# EasyEDA Pro project stm32-devboard.epro

# Schematic Schematic1
Board Name: Board1; Create Date: 2026-01-26; Page Name: P1; Project Name: stm32-devboard; Schematic Name: Schematic1; Update Date: 2026-01-27; Company: EasyEDA.com; Page Size: A4; Version: V1.0
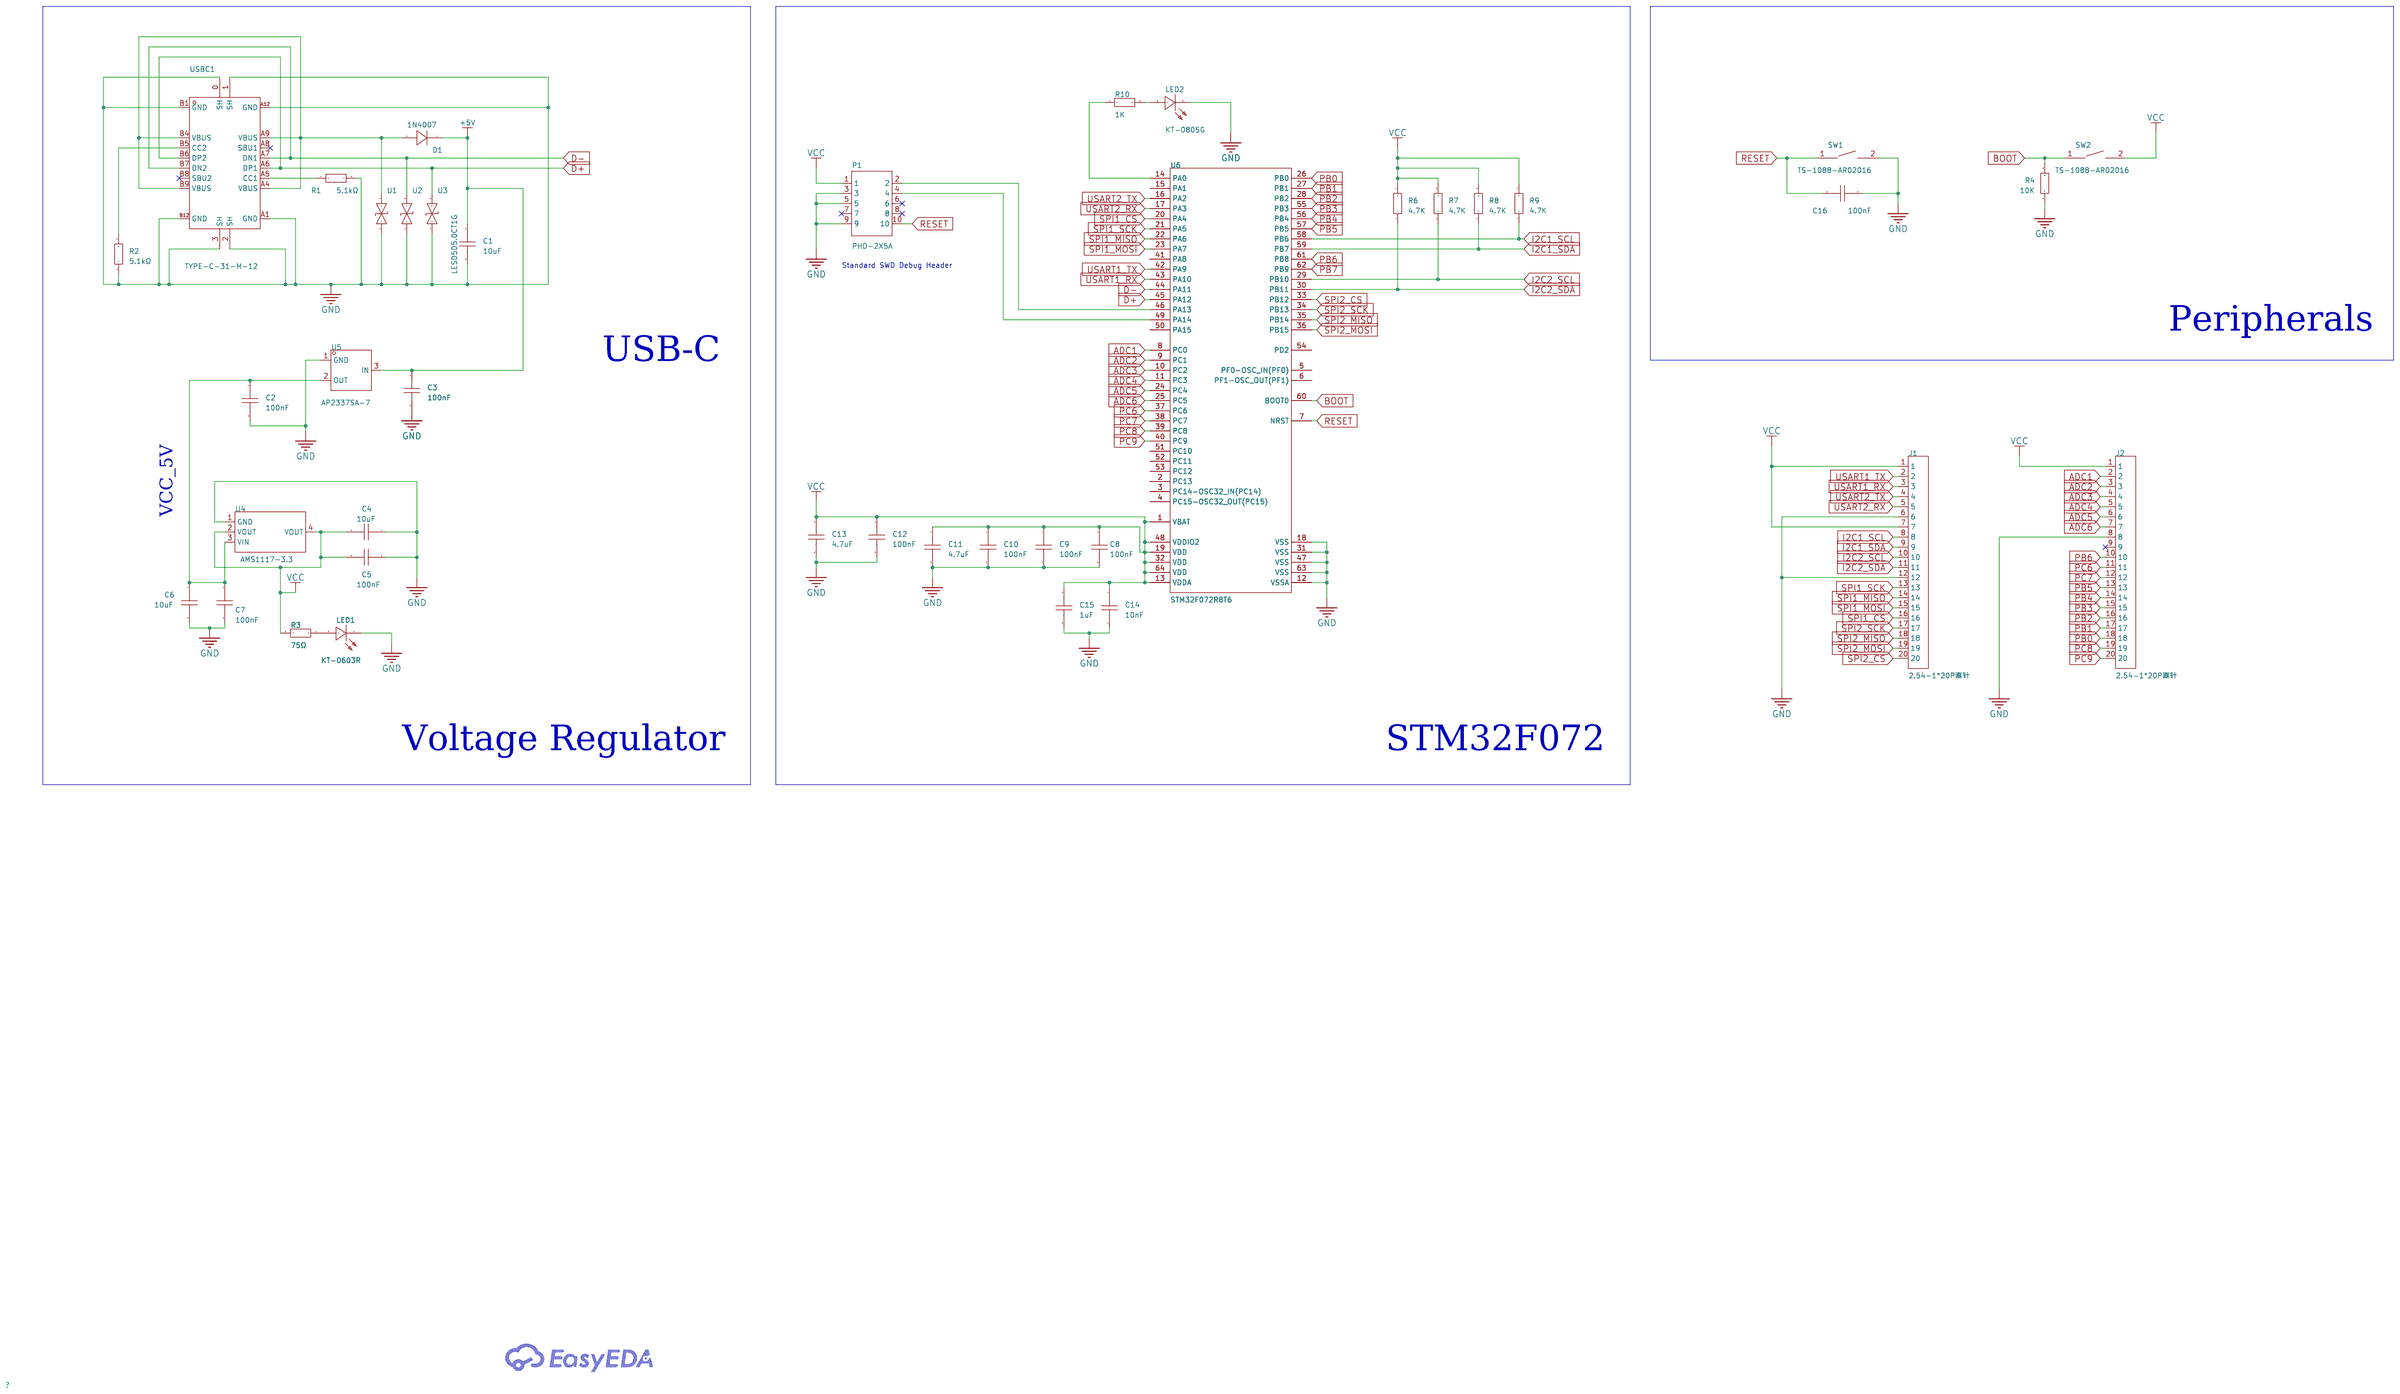
[diagram p0: schematic sheet]

## Parts
C1  10uF  [C0603]
C2  100nF  [C0603]
C3  100nF  [C0603]
C4  10uF  [C0603]
C5  100nF  [C0603]
C6  10uF  [C0603]
C7  100nF  [C0603]
C8  100nF  [C0603]
C9  100nF  [C0603]
C10  100nF  [C0603]
C11  4.7uF  [C0603]
C12  100nF  [C0603]
C13  4.7uF  [C0603]
C14  10nF  [C0603]
C15  1uF  [C0603]
C16  100nF  [C0603]
D1  1N4007  [SMA_L4.3-W2.5-LS5.0-RD]
J1  2.54-1*20P直针  [HDR-TH_20P-P2.54-V-M-1]
J2  2.54-1*20P直针  [HDR-TH_20P-P2.54-V-M-1]
LED1  KT-0603R  [LED0603-RD]
LED2  KT-0805G  [LED0805-R-RD]
P1  PHD-2X5A  [CONN-TH_10P-P2.00_PHD2.0MM-2X5]
R1  5.1kΩ  [R0603]
R2  5.1kΩ  [R0603]
R3  75Ω  [R0603]
R4  10K  [R0603]
R6  4.7K  [R0603]
R7  4.7K  [R0603]
R8  4.7K  [R0603]
R9  4.7K  [R0603]
R10  1K  [R0603]
SW1  TS-1088-AR02016  [SW-SMD_L3.9-W3.0-P4.45]
SW2  TS-1088-AR02016  [SW-SMD_L3.9-W3.0-P4.45]
U1  LESD5D5.0CT1G  [SOD-523_L1.2-W0.8-LS1.6-BI]
U2  LESD5D5.0CT1G  [SOD-523_L1.2-W0.8-LS1.6-BI]
U3  LESD5D5.0CT1G  [SOD-523_L1.2-W0.8-LS1.6-BI]
U4  AMS1117-3.3  [SOT-223-3_L6.5-W3.4-P2.30-LS7.0-BR]
U5  AP2337SA-7  [SOT-23-3_L2.9-W1.3-P1.90-LS2.4-BR]
U6  STM32F072R8T6  [LQFP-64_L10.0-W10.0-P0.50-LS12.0-BL]
USBC1  TYPE-C-31-M-12  [USB-C_SMD-TYPE-C-31-M-12]

## Library data of the parts
C1 C4 C6 = CL10A106KP8NNNC: Capacitance:10uF Tolerance:±10% Tolerance:±10% Voltage Rating:10V Temperature Coefficient:X5R; LCSC Part Name: 10uF ±10% 10V; Supplier Part: C19702; Manufacturer: SAMSUNG(三星); Supplier Footprint: 0603; JLCPCB Part Class: Basic Part; Datasheet: https://item.szlcsc.com/datasheet/CL10A106KP8NNNC/20411.html; Supplier: LCSC; Tolerance: ±10%; Voltage Rating: 10V; Temperature Coefficient: X5R
C2 C3 C5 C7 = CC0603KRX7R9BB104: Capacitance:100nF Tolerance:±10% Tolerance:±10% Voltage Rating:50V Temperature Coefficient:X7R; LCSC Part Name: 100nF ±10% 50V; Supplier Part: C14663; Manufacturer: YAGEO(国巨); Supplier Footprint: 0603; JLCPCB Part Class: Basic Part; Datasheet: https://item.szlcsc.com/datasheet/CC0603KRX7R9BB104/15331.html; Supplier: LCSC; Tolerance: ±10%; Voltage Rating: 50V; Temperature Coefficient: X7R
C8-C16 = CAP_0603: Supplier Footprint: 0603
D1 = 1N4007_C727081: Diode Configuration:Independent Voltage - Forward(Vf@If):1.1V@1A Voltage - DC Reverse(Vr):1kV Current - Rectified:1A Reverse Leakage Current (Ir):5uA; Supplier Part: C727081; Manufacturer: TWGMC(迪嘉); Supplier Footprint: SMA(DO-214AC); JLCPCB Part Class: Extended Part; Datasheet: https://item.szlcsc.com/datasheet/1N4007/774186.html; Supplier: LCSC; Diode Configuration: Independent; Voltage - Forward(Vf@If): 1.1V@1A; Voltage - DC Reverse(Vr): 1kV; Current - Rectified: 1A; Reverse Leakage Current (Ir): 5uA
J1 J2 = 2.54-1*20P直针: Pin Structure:1x20P Pitch:2.54mm Row Spacing:- Circluar Pins/Square Pins:Pin Header Mounting Type:Through Hole Number of Rows:1 Number of Pins:20P Current Rating:3A Voltage Rating (Max):- Length of Mating Pin:- Insulation Height:- Length of End Connection; LCSC Part Name: 1x20P 间距:2.54mm 方针 直插; Supplier Part: C50981; Manufacturer: BOOMELE(博穆精密); Supplier Footprint: 插件,P=2.54mm; JLCPCB Part Class: Extended Part; Datasheet: https://item.szlcsc.com/datasheet/2.54-1*20P%25E7%259B%25B4%25E9%2592%2588/51993.html; Supplier: LCSC; Pin Structure: 1x20P; Pitch: 2.54mm; Circluar Pins/Square Pins: Pin Header; Mounting Type: Through Hole; Number of Rows: 1; Number of Pins: 20P; Current Rating: 3A; Contact Material: Brass; Operating Temperature: -40℃~+105℃; Color: Black
LED1 = KT-0603R: Emitted Color:Red Power Dissipation:- Forward Current:- Dominant Wavelength:- Dominant Wavelength:- Peak Wavelength:- Diode Configuration:- Lens Color:- Color Temperature:- Color Temperature:- Viewing Angle:- Mounting Sytle:- Operating Temperature:-40℃~+8; LCSC Part Name: 0603 红灯 高亮; Supplier Part: C2286; Manufacturer: KENTO; Supplier Footprint: 0603; JLCPCB Part Class: Basic Part; Datasheet: https://atta.szlcsc.com/upload/public/pdf/source/20160616/1466072038404.pdf; Supplier: LCSC; Emitted Color: Red; Operating Temperature: -40℃~+85℃
LED2 = KT-0805G: Lamp Holder Type:- Illumination Color:Emerald Green Voltage - Forward(Vf):2.6V~3.1V Voltage - Forward(Vf):2.6V~3.1V Power(Watts):100mW Forward Current:5mA Wavelength - Dominant:513nm~528nm Wavelength - Dominant:513nm~528nm Peak Wavelength:525nm Diode Conf; LCSC Part Name: 0805 翠绿 高亮; Supplier Part: C2297; Manufacturer: KENTO; Supplier Footprint: 0805; JLCPCB Part Class: Basic Part; Datasheet: https://item.szlcsc.com/datasheet/KT-0805G/2670.html; Supplier: LCSC; Illumination Color: Emerald Green; Voltage - Forward(Vf): 2.6V~3.1V; Power(Watts): 100mW; Forward Current: 5mA; Wavelength - Dominant: 513nm~528nm; Peak Wavelength: 525nm; Luminous Intensity: 430mcd; Viewing Angle: 120°; Operating Temperature: -40℃~+85℃
P1 = PHD-2X5A: Pins Structure:2x5P Pitch:2mm Mounting Type:Through Hole Reference Series:PHD Number of Pins:10P Number of Rows:2 Number of PINs Per Row:5 Row Spacing:2mm Current Rating:2A Contact Material:- Contact Plating:- Operating Temperature:-25℃~+85℃ Operating Tem; LCSC Part Name: 2x5P 间距:2mm 直插 系列:PHD; Supplier Part: C49123; Manufacturer: BOOMELE(博穆精密); Supplier Footprint: 插件,P=2mm; JLCPCB Part Class: Extended Part; Datasheet: https://item.szlcsc.com/datasheet/PHD-2X5A/50131.html; Supplier: LCSC; Pins Structure: 2x5P; Pitch: 2mm; Mounting Type: Through Hole; Reference Series: PHD; Number of Pins: 10P; Number of Rows: 2; Number of PINs Per Row: 5; Row Spacing: 2mm; Current Rating: 2A; Operating Temperature: -25℃~+85℃; Voltage Rating: 250V; Plastic Material: PA; Flame Retardant Rating: UL94V-0; Color: Beige; Z-Height of the Board: 6.6mm
R1 R2 = 0603WAF5101T5E: Type:Thick Film Resistor Resistance:5.1kΩ Tolerance:±1% Tolerance:±1% Power(Watts):100mW Voltage-Supply(Max):75V Temperature Coefficient:±100ppm/℃ Temperature Coefficient:±100ppm/℃ Operating Temperature:-55℃~+155℃ Operating Temperature:-55℃~+155℃; LCSC Part Name: 5.1kΩ ±1% 100mW 厚膜电阻; Supplier Part: C23186; Manufacturer: UNI-ROYAL(厚声); Supplier Footprint: 0603; JLCPCB Part Class: Basic Part; Datasheet: https://item.szlcsc.com/datasheet/0603WAF5101T5E/23913.html; Supplier: LCSC; Type: Thick Film Resistor; Tolerance: ±1%; Power(Watts): 100mW; Voltage-Supply(Max): 75V; Temperature Coefficient: ±100ppm/℃; Operating Temperature: -55℃~+155℃
R3 = 0603WAF750JT5E: Type:Thick Film Resistor Resistance:75Ω Tolerance:±1% Tolerance:±1% Power(Watts):100mW Voltage-Supply(Max):75V Temperature Coefficient:±100ppm/℃ Temperature Coefficient:±100ppm/℃ Operating Temperature:-55℃~+155℃ Operating Temperature:-55℃~+155℃; LCSC Part Name: 75Ω ±1% 100mW 厚膜电阻; Supplier Part: C4275; Manufacturer: UNI-ROYAL(厚声); Supplier Footprint: 0603; JLCPCB Part Class: Basic Part; Datasheet: https://item.szlcsc.com/datasheet/0603WAF750JT5E/4682.html; Supplier: LCSC; Type: Thick Film Resistor; Tolerance: ±1%; Power(Watts): 100mW; Voltage-Supply(Max): 75V; Temperature Coefficient: ±100ppm/℃; Operating Temperature: -55℃~+155℃
R4 R6-R10 = Res_0603: Supplier Footprint: 0603
SW1 SW2 = TS-1088-AR02016: Circuit:SPST Actuator Style:Round Button Operating Force:1.6N Mounting Type:Surface Mount,Vertical Length:4mm Width:3mm Switch Height:2mm with Bracket:Without Bracket Contact Current:50mA Voltage Rating:12V Actuator/Cap Color:Black Termination Style:SMD(S; LCSC Part Name: 4*3*2mm 立贴 轻触开关; Supplier Part: C720477; Manufacturer: XUNPU(讯普); Supplier Footprint: SMD,4x3mm; JLCPCB Part Class: Basic Part; Datasheet: https://item.szlcsc.com/datasheet/TS-1088-AR02016/763484.html; Supplier: LCSC; Circuit: SPST; Actuator Style: Round Button; Operating Force: 1.6N; Mounting Type: Surface Mount,Vertical; Length: 4mm; Width: 3mm; Switch Height: 2mm; with Bracket: Without Bracket; Contact Current: 50mA; Voltage Rating: 12V; Actuator/Cap Color: Black; Termination Style: SMD(SMT) Tab; Life: 100,000 Cycles; Operating Temperature: -30℃~+80℃
U1-U3 = LESD5D5.0CT1G_C5246195: Supplier Part: C5246195; Manufacturer: Leiditech(雷卯电子); Supplier Footprint: SOD-523; JLCPCB Part Class: Extended Part; Datasheet: https://atta.szlcsc.com/upload/public/pdf/source/20221108/1C42B36F7D16189BC2911DA9C8277455.pdf; Supplier: LCSC
U4 = AMS1117-3.3_C6186: Output Type:Fixed Voltage - Supply:16V Output Voltage:3.3V Output Voltage:3.3V Output Current:1A Power Supply Rejection Ratio (PSRR):72dB@(120Hz) Voltage Dropout:1.1V@(800mA) standby current:5mA Noise:- Features:Over Current Protection；Over Temperature Pr; LCSC Part Name: 输出3.3V 1A; Supplier Part: C6186; Manufacturer: AMS; Supplier Footprint: SOT-223; JLCPCB Part Class: Basic Part; Datasheet: https://item.szlcsc.com/datasheet/AMS1117-3.3/6652.html; Supplier: LCSC; Output Type: Fixed; Voltage - Supply: 16V; Output Voltage: 3.3V; Output Current: 1A; Power Supply Rejection Ratio (PSRR): 72dB@(120Hz); Voltage Dropout: 1.1V@(800mA); standby current: 5mA; Features: Over Current Protection；Over Temperature Protection; Operating Temperature: -40℃~+125℃; Output Configuration: Positive; Number of Outputs: 1
U5 = AP2337SA-7: Type:Load Switch Number of Channels:1 Control Input Logic:- Maximum Continuous Current:1A Voltage - Supply:2.7V~5.5V Voltage - Supply:2.7V~5.5V RDS(on):110mΩ Operating Temperature	-:-40℃~+85℃ Operating Temperature	-:-40℃~+85℃ Features:Over Temperature Pro; LCSC Part Name: 1.0A单通道限流负载开关; Supplier Part: C150497; Manufacturer: DIODES(美台); Supplier Footprint: SOT-23; JLCPCB Part Class: Extended Part; Datasheet: https://item.szlcsc.com/datasheet/AP2337SA-7/161835.html; Supplier: LCSC; Type: Load Switch; Number of Channels: 1; Maximum Continuous Current: 1A; Voltage - Supply: 2.7V~5.5V; RDS(on): 110mΩ; Operating Temperature	-: -40℃~+85℃; Features: Over Temperature Protection；Over Voltage Protection；Short-Circuit  Protection(SCP)；Overcurrent Protection(OCP)；Undervoltage Protection(UVP)
U6 = STM32F072R8T6: CPU Core:ARM-M0 CPU Maximum Speed:48MHz Program Storage Size:64KB Number of I/O:51 ADC (Bit):12bit DAC (Bit):12bit Low Voltage Detection Threshold:1.65V~3.6V Low Voltage Detection Threshold:1.65V~3.6V Application Area:-; LCSC Part Name: 主流ARM Cortex-M0 USB系列MCU，具有64 KB Flash、48 MHz CPU、USB、CAN和CEC功能; Supplier Part: C87900; Manufacturer: ST(意法半导体); Supplier Footprint: LQFP-64(10x10); JLCPCB Part Class: Extended Part; Datasheet: https://atta.szlcsc.com/upload/public/pdf/source/20170105/1483610796165.pdf; Supplier: LCSC; CPU Core: ARM-M0; CPU Maximum Speed: 48MHz; Program Storage Size: 64KB; Number of I/O: 51; ADC (Bit): 12bit; DAC (Bit): 12bit; Low Voltage Detection Threshold: 1.65V~3.6V
USBC1 = TYPE-C-31-M-12: Connector Type:Type-C Standard:- Gender:Female Mounting Style:- Number of Contacts:16P Number of Ports:1 Current Rating - Power (Max):5A Operating Temperature Range:- Operating Temperature Range:-; LCSC Part Name: Type-C 母; Supplier Part: C165948; Manufacturer: 韩国韩荣; Supplier Footprint: SMD; JLCPCB Part Class: Extended Part; Datasheet: https://atta.szlcsc.com/upload/public/pdf/source/20220525/466408E853115E789EDB0DDC29077C05.pdf; Supplier: LCSC; Connector Type: Type-C; Gender: Female; Number of Contacts: 16P; Number of Ports: 1; Current Rating - Power (Max): 5A

## Nets
+5V: C1.1 C3.1 D1.1(K) U5.3(IN)
GND: C1.2 C2.2 C3.2 C4.1 C5.1 C6.2 C7.2 C8.2 C9.2 C10.2 C11.2 C12.2 C13.2 C14.2 C15.2 C16.1 J1.6 J1.12 J2.8 LED1.1(K) LED2.2(K) P1.3 P1.5 P1.9 R1.2 R2.1 R4.1 SW1.2 U1.1 U2.1 U3.1 U4.1(GND) U5.1(GND) U6.12(VSSA) U6.18(VSS) U6.31(VSS) U6.47(VSS) U6.63(VSS) USBC1.0(SH) USBC1.1(SH) USBC1.2(SH) USBC1.3(SH) USBC1.A1(GND) USBC1.A12(GND) USBC1.B1(GND) USBC1.B12(GND)
VCC: C4.2 C5.2 C8.1 C9.1 C10.1 C11.1 C12.1 C13.1 C14.1 C15.1 J1.1 J1.7 J2.1 P1.1 R3.2 R6.2 R7.2 R8.2 R9.2 SW2.2 U4.2(VOUT) U4.4(VOUT) U6.1(VBAT) U6.13(VDDA) U6.19(VDD) U6.32(VDD) U6.48(VDDIO2) U6.64(VDD)
ADC1: J2.2 U6.8(PC0)
ADC2: J2.3 U6.9(PC1)
ADC3: J2.4 U6.10(PC2)
ADC4: J2.5 U6.11(PC3)
ADC5: J2.6 U6.24(PC4)
ADC6: J2.7 U6.25(PC5)
BOOT: R4.2 SW2.1 U6.60(BOOT0)
D+: U3.2 U6.45(PA12) USBC1.A6(DP1) USBC1.B6(DP2)
D-: U2.2 U6.44(PA11) USBC1.A7(DN1) USBC1.B7(DN2)
I2C1_SCL: J1.8 R9.1 U6.58(PB6)
I2C1_SDA: J1.9 R8.1 U6.59(PB7)
I2C2_SCL: J1.10 R7.1 U6.29(PB10)
I2C2_SDA: J1.11 R6.1 U6.30(PB11)
PB0: J2.18 U6.26(PB0)
PB1: J2.17 U6.27(PB1)
PB2: J2.16 U6.28(PB2)
PB3: J2.15 U6.55(PB3)
PB4: J2.14 U6.56(PB4)
PB5: J2.13 U6.57(PB5)
PB6: J2.10 U6.61(PB8)
PB7: U6.62(PB9)
PC6: J2.11 U6.37(PC6)
PC7: J2.12 U6.38(PC7)
PC8: J2.19 U6.39(PC8)
PC9: J2.20 U6.40(PC9)
RESET: C16.2 P1.10 SW1.1 U6.7(NRST)
SPI1_CS: J1.16 U6.20(PA4)
SPI1_MISO: J1.14 U6.22(PA6)
SPI1_MOSI: J1.15 U6.23(PA7)
SPI1_SCK: J1.13 U6.21(PA5)
SPI2_CS: J1.20 U6.33(PB12)
SPI2_MISO: J1.18 U6.35(PB14)
SPI2_MOSI: J1.19 U6.36(PB15)
SPI2_SCK: J1.17 U6.34(PB13)
USART1_RX: J1.3 U6.43(PA10)
USART1_TX: J1.2 U6.42(PA9)
USART2_RX: J1.5 U6.17(PA3)
USART2_TX: J1.4 U6.16(PA2)
$1N878: R1.1 USBC1.A5(CC1)
$1N879: R2.2 USBC1.B5(CC2)
$1N882: D1.2(A) U1.2 USBC1.A4(VBUS) USBC1.A9(VBUS) USBC1.B4(VBUS) USBC1.B9(VBUS)
$1N887: LED1.2(A) R3.1
$1N888: C2.1 C6.1 C7.1 U4.3(VIN) U5.2(OUT)
$1N4590: P1.2 U6.46(PA13)
$1N4596: P1.4 U6.49(PA14)
$1N7474: LED2.1(A) R10.2
$1N7510: R10.1 U6.14(PA0)

Not connected (* = marked no-connect by the designer): J2 9*; P1 6* 7* 8*; U6 2(PC13) 3(PC14-OSC32_IN(PC14)) 4(PC15-OSC32_OUT(PC15)) 5(PF0-OSC_IN(PF0)) 6(PF1-OSC_OUT(PF1)) 15(PA1) 41(PA8) 50(PA15) 51(PC10) 52(PC11) 53(PC12) 54(PD2); USBC1 A8(SBU1)* B8(SBU2)*

## Notes on the sheet
- Standard SWD Debug Header
- Peripherals
- USB-C
- VCC_5V
- Voltage Regulator
- STM32F072

# Board PCB1
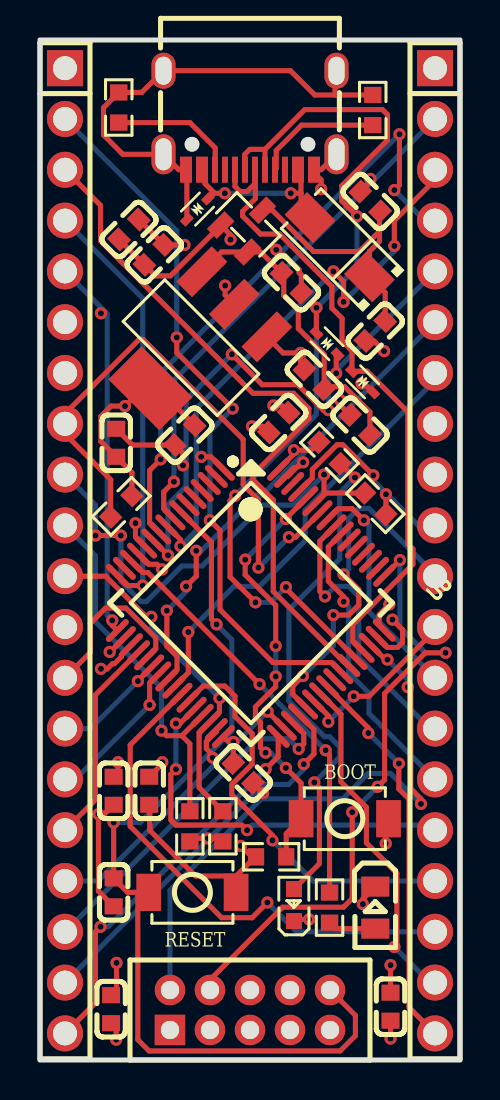
[diagram p1: board, top side]
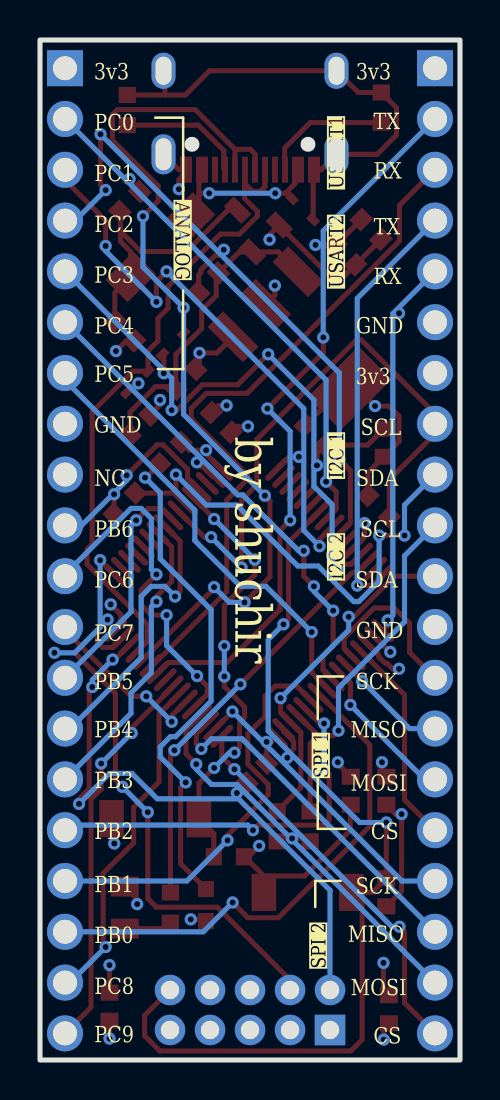
[diagram p2: board, bottom side, seen from below]

Outline 21 x 51 mm; copper layers: Top Layer, Ground, Power, Bottom Layer. Coordinates in mm from the lower left corner of the outline.
Outline path: rectangle 0,51 21,0
Stack: Top Layer 0.035mm Outer layer thickness 1oz / Dielectric1 0.2104mm 7628 RC49% 8.6mil / Ground 0.0152mm Inner layer thickness / Dielectric2 1.065mm 1.1mm H/HOZ Copper / Power 0.0152mm Inner layer thickness / Dielectric3 0.2104mm 7628 RC49% 8.6mil / Bottom Layer 0.035mm Outer layer thickness 1oz

## Design rules (mm)
template: Custom Config
spacing copperThickness1oz (default): track to track 0.102, other pairs 0.152 to 0.3
spacing copperThickness2oz: track to track 0.203, other pairs 0.152 to 0.3
track width copperThickness1oz (default): min 0.127, default 0.254, max 2.54
track width copperThickness2oz: min 0.203, default 0.254, max 2.54
differential pair differentialPair (default): width min 0.127, default 0.254, max 2.54; gap min 0.152, default 0.152
via viaSize (default): diameter min 0.5, default 0.61, max 10; hole min 0.3, default 0.305, max 6.3

## Placement (name value [footprint] x y rotation side)
C1  10uF  [C0603]  16.76 36.45 225 top
C2  100nF  [C0603]  12.57 38.86 315 top
C3  100nF  [C0603]  16.51 42.93 135 top
C4  10uF  [C0603]  5.72 40.26 45 top
C5  100nF  [C0603]  4.44 41.53 45 top
C6  10uF  [C0603]  13.72 34.04 135 top
C7  100nF  [C0603]  16 31.75 135 top
C8  100nF  [C0603]  10.16 14.35 315 top
C9  100nF  [C0603]  17.53 2.67 270 top
C10  100nF  [C0603]  11.94 31.88 45 top
C11  4.7uF  [C0603]  7.24 31.24 225 top
C12  100nF  [C0603]  3.68 13.46 270 top
C13  4.7uF  [C0603]  3.81 30.86 90 top
C14  10nF  [C0603]  3.56 2.54 270 top
C15  1uF  [C0603]  5.46 13.46 270 top
C16  100nF  [C0603]  3.68 8.38 90 top
D1  1N4007  [SMA_L4.3-W2.5-LS5.0-RD]  14.99 40.64 135 top
J1  2.54-1*20P直针  [HDR-TH_20P-P2.54-V-M-1]  1.25 25.46 270 top
J2  2.54-1*20P直针  [HDR-TH_20P-P2.54-V-M-1]  19.75 25.46 270 top
LED1  KT-0603R  [LED0603-RD]  12.7 7.75 90 top
LED2  KT-0805G  [LED0805-R-RD]  16.76 7.62 270 top
P1  PHD-2X5A  [CONN-TH_10P-P2.00_PHD2.0MM-2X5]  10.5 2.5 0 top
R1  5.1kΩ  [R0603]  16.64 47.5 90 top
R2  5.1kΩ  [R0603]  3.94 47.62 270 top
R3  75Ω  [R0603]  14.48 30.35 135 top
R4  10K  [R0603]  11.56 10.16 0 top
R6  4.7K  [R0603]  9.14 11.68 270 top
R7  4.7K  [R0603]  7.49 11.68 270 top
R8  4.7K  [R0603]  16.76 27.81 315 top
R9  4.7K  [R0603]  4.06 27.69 45 top
R10  1K  [R0603]  14.48 7.62 270 top
SW1  TS-1088-AR02016  [SW-SMD_L3.9-W3.0-P4.45]  7.62 8.38 0 top
SW2  TS-1088-AR02016  [SW-SMD_L3.9-W3.0-P4.45]  15.24 12.06 0 top
U1  LESD5D5.0CT1G  [SOD-523_L1.2-W0.8-LS1.6-BI]  7.87 42.55 45 top
U2  LESD5D5.0CT1G  [SOD-523_L1.2-W0.8-LS1.6-BI]  14.35 35.81 135 top
U3  LESD5D5.0CT1G  [SOD-523_L1.2-W0.8-LS1.6-BI]  16.13 33.91 135 top
U4  AMS1117-3.3  [SOT-223-3_L6.5-W3.4-P2.30-LS7.0-BR]  7.62 35.69 45 top
U5  AP2337SA-7  [SOT-23-3_L2.9-W1.3-P1.90-LS2.4-BR]  10.41 41.78 225 top
U6  STM32F072R8T6  [LQFP-64_L10.0-W10.0-P0.50-LS12.0-BL]  10.54 22.86 225 top
USBC1  TYPE-C-31-M-12  [USB-C_SMD-TYPE-C-31-M-12]  10.5 46.99 180 top

## Footprints (pads in the part's own frame, mm; a bottom-side part is the same pattern mirrored in y, then rotated)
C0603
  rect 0.8x0.9 smd: 1(-0.7,0) 2(0.7,0)
CONN-TH_10P-P2.00_PHD2.0MM-2X5
  rect 1.524x1.524 hole 0.914: 1(-4,-1)
  round 1.524 hole 0.914: 2(-4,1) 3(-2.002,-1) 4(-2.002,1) 5(0,-1) 6(0,1) 7(1.999,-1) 8(1.999,1) 9(4,-1) 10(4,1)
HDR-TH_20P-P2.54-V-M-1
  rect 1.8x1.8 hole 1.2: 1(-24.13,0)
  round 1.8 hole 1.2: 2(-21.59,0) 3(-19.05,0) 4(-16.51,0) 5(-13.97,0) 6(-11.43,0) 7(-8.89,0) 8(-6.35,0) 9(-3.81,0) 10(-1.27,0) 11(1.27,0) 12(3.81,0) 13(6.35,0) 14(8.89,0) 15(11.43,0) 16(13.97,0) 17(16.51,0) 18(19.05,0) 19(21.59,0) 20(24.13,0)
LED0603-RD
  rect 0.8x0.8 smd: 1(-0.799,0) 2(0.799,0)
LED0805-R-RD
  rect 1x1.399 smd: 1(1.05,0) 2(-1.05,0)
LQFP-64_L10.0-W10.0-P0.50-LS12.0-BL
  oval 0.3x1.5 smd: 1(-3.75,-5.688) 2(-3.25,-5.688) 3(-2.75,-5.688) 4(-2.25,-5.688) 5(-1.75,-5.688) 6(-1.25,-5.688) 7(-0.75,-5.688) 8(-0.25,-5.688) 9(0.25,-5.688) 10(0.75,-5.688) 11(1.25,-5.688) 12(1.75,-5.688) 13(2.25,-5.688) 14(2.75,-5.688) 15(3.25,-5.688) 16(3.75,-5.688) 33(3.75,5.688) 34(3.25,5.688) 35(2.75,5.688) 36(2.25,5.688) 37(1.75,5.688) 38(1.25,5.688) 39(0.75,5.688) 40(0.25,5.688) 41(-0.25,5.688) 42(-0.75,5.688) 43(-1.25,5.688) 44(-1.75,5.688) 45(-2.25,5.688) 46(-2.75,5.688) 47(-3.25,5.688) 48(-3.75,5.688)
  oval 1.5x0.3 smd: 17(5.7,-3.738) 18(5.7,-3.238) 19(5.7,-2.738) 20(5.7,-2.238) 21(5.7,-1.738) 22(5.7,-1.238) 23(5.7,-0.739) 24(5.7,-0.238) 25(5.7,0.262) 26(5.7,0.762) 27(5.7,1.262) 28(5.7,1.762) 29(5.7,2.261) 30(5.7,2.762) 31(5.7,3.261) 32(5.7,3.762) 49(-5.7,3.762) 50(-5.7,3.261) 51(-5.7,2.762) 52(-5.7,2.261) 53(-5.7,1.762) 54(-5.7,1.262) 55(-5.7,0.762) 56(-5.7,0.262) 57(-5.7,-0.238) 58(-5.7,-0.739) 59(-5.7,-1.238) 60(-5.7,-1.738) 61(-5.7,-2.238) 62(-5.7,-2.738) 63(-5.7,-3.238) 64(-5.7,-3.738)
R0603
  rect 0.806x0.864 smd: 1(-0.753,0) 2(0.753,0)
SMA_L4.3-W2.5-LS5.0-RD
  rect 2x1.593 smd: 1(-2.1,0) 2(2.1,0)
SOD-523_L1.2-W0.8-LS1.6-BI
  rect 0.6x0.4 smd: 1(-0.75,0) 2(0.75,0)
SOT-23-3_L2.9-W1.3-P1.90-LS2.4-BR
  rect 1.25x0.7 smd: 1(1,-0.95) 2(1,0.95) 3(-1,0)
SOT-223-3_L6.5-W3.4-P2.30-LS7.0-BR
  rect 2.5x1.1 smd: 1(2.97,-2.3) 2(2.97,0) 3(2.97,2.3)
  rect 2.34x3.6 smd: 4(-2.97,0)
SW-SMD_L3.9-W3.0-P4.45
  rect 1.23x1.86 smd: 1(-2.185,0) 2(2.185,0)
USB-C_SMD-TYPE-C-31-M-12
  oval 1.2x2 hole 0.8x1.6: 0(-4.325,1.706) 1(4.325,1.706)
  oval 1.2x1.8 hole 0.8x1.4: 2(4.325,-2.474) 3(-4.325,-2.474)
  rect 0.3x1.3 smd: A1(-3.35,2.474) A4(-2.55,2.474) A5(-1.25,2.474) A6(-0.25,2.474) A7(0.25,2.474) A8(1.25,2.474) A9(2.55,2.474) A12(3.35,2.474) B1(3.05,2.474) B4(2.25,2.474) B5(1.75,2.474) B6(0.75,2.474) B7(-0.75,2.474) B8(-1.75,2.474) B9(-2.25,2.474) B12(-3.05,2.474)

## Nets
As in the schematic.

Pads without a net: J2 9; P1 6 7 8; U6 2 3 4 5 6 15 41 50 51 52 53 54; USBC1 A8 B8

## Via types
v1: diameter 0.61, hole 0.305, Top Layer to Bottom Layer, 119 vias

## Routing (per net, layer and track width the routed paths; a pad name or vN(x,y) marks a point on that pad's centre or on a via; arc(x,y) is an arc through that point)
+5V: length 13.2
  Top Layer w0.254: 16.98,41.44 15.96,40.42 13.68,40.42 11.61,42.49 11.12,42.49 ; 16.98,41.44 16.98,40.93 16.47,40.42 16.47,39.16 17.26,38.37 17.26,36.94 ; 16.98,41.44 16.98,42.41 C3.1
GND: length 83.4
  Top Layer w0.254: C15.2 5.49,12.74 5.49,11.49 7.77,9.2 9.81,9.2 ; 16.86,21.14 17.37,20.63 17.88,20.63 18.13,20.88 18.13,21.51 v1(17.62,22.02) ; 14.75,48.25 14.75,49.39 USBC1.3 ; 14.75,48.25 R1.2 ; 14.75,48.25 13.74,48.25 12.53,49.46 USBC1.2 5.09,48.38 R2.1 3.18,47.62 3.18,46.25 4.14,45.28 USBC1.1 6.94,44.52 USBC1.A12 7.26,44.41 7.34,44.41 ; U6.12 4.77,26.15 v1(4.77,26.85) ; U4.1 12.15,35.35 v1(13.03,35.35) 13.03,34.72 13.22,34.53 ; v1(16.52,44.05) 16.52,43.93 C3.2 ; 10.55,10.2 10.76,10.2 R4.1 ; 10.55,10.2 10.55,9.94 9.81,9.2 ; 10.55,10.2 v1(10.04,10.71) ; v1(9.53,41.02) 9.53,41.26 U5.1 9.03,41.72 6.52,39.21 5.78,39.21 C4.1 C5.1 ; 9.81,9.2 SW1.2 ; U3.1 16.21,33.83 v1(16.08,33.83) ; U6.18 3.5,20.4 v1(3.48,20.4) ; v1(14.81,34.34) 14.81,35.21 U2.1 ; C16.1 2.92,8.44 v1(2.92,12.29) 3.21,12.29 C12.2 ; v1(11.67,32.73) 12.08,32.73 C10.2 ; LED1.1 12.78,7.03 v1(13.46,7.03) ; LED2.2 16.14,8.05 v1(16.14,7.79) ; v1(3.81,1.02) 3.81,1.59 C14.2 ; C7.2 15,32.75 v1(15,33) ; 7.34,44.41 USBC1.B1 ; 7.34,44.41 U1.1 ; 16.27,35.95 16.69,35.95 v1(17.2,35.45) ; C9.2 v1(17.53,1.07) ; v1(7.15,29.73) 7.15,30.34 C11.2 4.62,30.75 C13.2 ; USBC1.0 14.06,44.52 USBC1.A1 USBC1.B12 14.06,44.01 v1(14.06,43.54) ; U6.63 12.38,29.18 12.88,29.68 12.95,29.68 v1(13.16,29.89) ; 11.16,13.35 10.66,13.86 ; v1(8.64,15.11) 8.64,15.25 8.32,15.57 8.32,15.92 8.82,16.42 U6.31 ; C2.2 13.07,39.26 12.96,39.37 12.96,39.51 12.23,40.24 12.09,40.24 v1(11.81,40.51)
  Ground w0.254: 1.25,36.89 2.6,36.89 v1(3.05,37.34) ; P1.5 P1.3
  vias: v1(11.16,13.35)
VCC: length 35.5
  Top Layer w0.254: R6.2 9,11.08 v1(8.4,11.08) 7.64,11.08 R7.2 ; SW2.2 17.29,11.93 v1(17.29,10.83) ; v1(7.23,40.75) C4.2 C5.2 ; 9.66,14.85 v1(9.67,15.91) 9.44,15.91 U6.32 ; U4.2 9.26,38.25 v1(9.26,38.72) ; U6.1 8.55,30.16 v1(8.06,30.16) ; C10.1 11.14,31.68 v1(10.6,31.68) ; v1(3.83,4.86) 3.83,3.51 C14.1 ; 17.22,21.49 16.96,21.74 16.96,22.27 v1(17.47,22.78) ; v1(6.11,24.53) 5.86,24.78 5.44,24.78 U6.13 ; v1(3.9,14.89) 3.9,14.38 C12.1 ; C11.1 5.88,33.59 5.52,33.59 5.39,33.46 5.01,33.46 v1(4.25,32.7) 3.56,32.7 3.05,32.19 3.05,30.92 C13.1 4.6,29.37 R9.2 ; U6.19 4.07,20.26 4.07,20.16 3.73,19.82 3.63,19.82 3.37,19.56 v1(3.05,19.56) ; R3.2 13.55,30.49 v1(12.69,30.49) 12.69,30.3 U6.64 ; v1(17.53,4.75) C9.1 ; v1(6.11,14.89) 6.11,14.81 C15.1 ; v1(17.3,28.29) R8.2
ADC1: length 25.8
  Top Layer w0.254: 6.7,27.06 6.19,27.57 6.19,28.41 v1(6.7,28.92)
  Bottom Layer w0.254: v1(6.7,28.92) 6.7,34 J2.2
ADC2: length 28.4
  Top Layer w0.254: v1(15.18,37.91) 15.18,38.92 v1(14.67,39.43) ; v1(7.03,25.69) 7.03,26.02 U6.9 ; v1(17.72,40.7) 17.72,41.97 19.75,44 J2.3
  Bottom Layer w0.254: v1(15.18,37.91) 17.72,40.45 v1(17.72,40.7) ; v1(14.67,39.43) 7.81,32.57 7.81,26.48 v1(7.03,25.69)
ADC3: length 30.9
  Top Layer w0.254: v1(17.97,46.29) 17.97,43.75 v1(17.72,43.5) ; U6.10 5.48,26.86 5.48,29.48 v1(6.03,30.03)
  Bottom Layer w0.254: J2.4 19.24,41.97 v1(17.72,43.5) ; v1(17.97,46.29) 6.03,34.35 v1(6.03,30.03)
ADC4: length 27.6
  Top Layer w0.254: v1(14.42,32.49) 14.16,32.49 12.89,33.76 11.11,33.76 v1(9.59,35.29) ; v1(6.4,25.24) U6.11
  Bottom Layer w0.254: J2.5 14.42,34.1 v1(14.42,32.49) ; v1(9.59,35.29) 7.3,33 7.3,28.68 6.4,27.78 v1(6.4,25.24)
ADC5: length 24.2
  Top Layer w0.254: v1(7.81,25.46) 7.81,24.19 v1(7.3,23.68) ; U6.24 6.85,19.51 6.85,20.18 6.34,20.69 v1(6.34,22.47)
  Bottom Layer w0.254: v1(7.81,25.46) 8.07,25.46 10.86,28.25 11.11,28.25 19.75,36.89 ; v1(7.3,23.68) 7.3,23.43 v1(6.34,22.47)
ADC6: length 21.9
  Top Layer w0.254: U6.25 7.42,19.36 v1(7.42,21.4)
  Bottom Layer w0.254: J2.7 19.75,33.98 13.26,27.49 13.26,25.97 10.97,23.68 9.7,23.68 v1(7.42,21.4)
BOOT: length 21.7
  Top Layer w0.254: v1(12.29,14.61) 13.06,13.84 SW2.1 12.31,11.32 R4.2 ; v1(11.78,19.18) 11.78,18.67 10.77,17.65 10.77,17.14 11.02,16.89 11.02,15.62 v1(11.28,15.37) ; U6.60 12.29,27.07 v1(12.29,27.05) ; v1(10.26,25.02) 10.26,24.26 11.78,22.73 v1(11.78,20.7)
  Bottom Layer w0.254: v1(10.26,25.02) v1(12.29,27.05) ; v1(11.78,19.18) v1(11.78,20.7) ; v1(11.28,15.37) 11.53,15.37 v1(12.29,14.61)
D+: length 32.5
  Top Layer w0.254: 10.77,43.84 10.77,43.08 10.13,42.43 10.13,42.2 11.03,41.3 11.98,41.3 14.59,38.68 14.59,37.59 15.1,37.08 15.1,35.95 15.6,35.46 U3.2 16.36,34.44 18.39,32.41 18.39,25.8 18.65,25.55 18.65,24.79 15.65,21.79 15.65,20.94 U6.45 ; 10.77,43.84 10.77,44.49 USBC1.A6 ; 10.77,43.84 10.36,43.43 10,43.43 9.75,43.68 USBC1.B6
D-: length 46.9
  Top Layer w0.254: 11.25,45.53 USBC1.B7 ; 11.25,45.53 13.24,47.52 17.12,47.52 17.38,47.27 17.38,46 15.09,43.71 15.09,42.95 v1(15.85,42.19) ; 11.25,45.53 10.49,45.53 10.23,45.28 10.23,44.53 USBC1.A7 ; v1(9.76,28.22) 9.5,27.96 9.5,24.15 v1(10.77,22.88) ; v1(12.3,23.64) 12.3,23.58 U6.44 ; U2.2 v1(13.82,37.61)
  Bottom Layer w0.254: v1(9.76,28.22) 13.82,32.28 v1(13.82,37.61) 15.85,39.65 v1(15.85,42.19) ; v1(10.77,22.88) 11.53,22.88 v1(12.3,23.64)
I2C1_SCL: length 29.6
  Top Layer w0.254: v1(10.92,24.62) 10.92,28 10.16,28.76 10.16,31.03 5.16,36.03 4.96,36.03 1.25,32.32 J1.8 1.25,31.3 3.54,29.02 3.54,27.16 ; U6.58 12.78,26.14 v1(12.44,26.14)
  Bottom Layer w0.254: v1(10.92,24.62) v1(12.44,26.14)
I2C1_SDA: length 24.2
  Top Layer w0.254: 14.2,28.25 14.29,28.35 R8.1 ; v1(2.77,26.22) v1(4.04,26.22) ; v1(14.2,29.27) 14.2,28.26 14.19,28.25 U6.59
  Bottom Layer w0.254: v1(2.77,26.22) 2.77,27.75 J1.9 ; v1(4.04,26.22) 4.04,23.94 5.06,22.92 5.31,22.92 7.09,24.7 8.11,24.7 11.16,27.75 12.68,27.75 v1(14.2,29.27)
I2C2_SCL: length 18.8
  Top Layer w0.254: R7.1 7.49,15.81 7.09,16.21 6.33,16.21 v1(6.08,16.47) ; 7.09,16.21 U6.29
  Bottom Layer w0.254: v1(6.08,16.47) 6.08,18.6 2.77,21.91 2.77,25.21 J1.10
I2C2_SDA: length 17.2
  Top Layer w0.254: R6.1 7.96,13.63 7.96,16.37 U6.30 8.97,17.38 v1(8.97,18.09) ; v1(5.57,22.16) 5.31,22.16 3.28,24.19 J1.11
  Bottom Layer w0.254: v1(5.57,22.16) 5.57,21.5 v1(8.97,18.09)
PB0: length 25.7
  Top Layer w0.254: 7.05,18.29 4.51,15.75 4.51,11.69 9.08,7.11 10.61,7.11 v1(11.37,7.88)
  Bottom Layer w0.254: J2.18 12.83,6.41 v1(11.37,7.88)
PB1: length 20.7
  Top Layer w0.254: v1(11.62,10.98) 11.62,11.24 9.59,13.27 9.59,13.78 10.61,14.79 10.61,16.32 9.75,17.18 9.75,18.19 9.24,18.7 8.16,18.7 U6.27
  Bottom Layer w0.254: J2.17 13.65,8.95 v1(11.62,10.98)
PB2: length 19.8
  Top Layer w0.254: v1(6.8,14.54) 6.54,14.28 6.54,12 6.8,11.75 10.1,11.75 v1(10.35,11.49) ; v1(6.8,16.83) 7,16.83 U6.28
  Bottom Layer w0.254: J2.16 19.5,11.75 10.61,11.75 v1(10.35,11.49) ; v1(6.8,14.54) v1(6.8,16.83)
PB3: length 14.8
  Top Layer w0.254: v1(15.18,22.92) 15.18,23.17 14.42,23.94 14.42,25.66 U6.55
  Bottom Layer w0.254: J2.15 16.45,17.33 16.45,18.35 15.43,19.36 15.43,22.67 v1(15.18,22.92)
PB4: length 14.4
  Top Layer w0.254: v1(14.25,23.17) 13.99,23.43 13.99,25.94 U6.56
  Bottom Layer w0.254: J2.14 19.5,16.57 15.94,20.13 15.94,23.17 15.43,23.68 14.76,23.68 v1(14.25,23.17)
PB5: length 11.6
  Top Layer w0.254: 14.4,27.06 14.91,27.57 15.61,27.57 v1(16.19,26.98)
  Bottom Layer w0.254: v1(16.19,26.98) 16.45,26.73 16.45,22.41 J2.13
PB6: length 9.8
  Top Layer w0.254: v1(16.67,29.23) 15.14,30.76 14.85,30.76 13.62,29.53 13.62,29.1 12.99,28.47
  Bottom Layer w0.254: J2.10 18.92,26.73 16.67,28.98 v1(16.67,29.23)
PC6: length 18
  Top Layer w0.254: U6.37 12.64,18.29 12.64,18.69 v1(13.15,19.2) ; v1(15.18,24.28) 15.94,23.52 15.94,22.75 15.43,22.25 v1(14.67,22.25)
  Bottom Layer w0.254: v1(15.18,24.28) 15.43,24.53 15.43,27.07 15.94,27.58 16.45,27.58 19.75,24.28 J2.11 ; v1(14.67,22.25) 14.67,20.72 v1(13.15,19.2)
PC7: length 8.7
  Top Layer w0.254: v1(14.42,16.91) 14.42,17.22 U6.38 ; J2.12 19.75,21.48 16.45,18.18 v1(15.69,18.18)
  Bottom Layer w0.254: v1(15.69,18.18) v1(14.42,16.91)
PC8: length 17.1
  Top Layer w0.254: v1(17.72,5.65) 17.84,5.77 17.84,9.33 16.32,10.86 16.32,12.64 15.05,13.91 15.05,17.29 U6.39
  Bottom Layer w0.254: J2.19 19.5,3.87 v1(17.72,5.65)
PC9: length 19.6
  Top Layer w0.254: v1(17.94,14.82) 17.94,13.55 18.45,13.05 18.45,2.63 J2.20 ; v1(16.42,16.35) 16.42,16.6 14.39,18.63 14.39,18.66
  Bottom Layer w0.254: v1(17.94,14.82) v1(16.42,16.35)
RESET: length 46.3
  Top Layer w0.254: 7.05,27.41 8.57,25.89 8.57,22.04 v1(8.83,21.78) ; 4.89,8.38 4.89,1.02 5.46,0.45 15.01,0.45 15.77,1.21 15.77,2.23 P1.10 ; 4.89,8.38 SW1.1 ; 4.89,8.38 4.38,8.38 C16.2 v1(3.68,11.88)
  Bottom Layer w0.254: v1(3.68,11.88) 5.02,11.88 9.59,16.45 9.59,21.02 v1(8.83,21.78)
SPI1_CS: length 10.4
  Top Layer w0.254: J1.16 2.77,13.02 2.77,18.26 U6.20
SPI1_MISO: length 5.7
  Top Layer w0.254: U6.22 4.89,18.96 v1(4.89,18.94)
  Bottom Layer w0.254: J1.14 2.52,16.57 v1(4.89,18.94)
SPI1_MOSI: length 7.6
  Top Layer w0.254: v1(5.48,17.75) 5.48,18.84 U6.23
  Bottom Layer w0.254: v1(5.48,17.75) 1.76,14.03 J1.15
SPI1_SCK: length 8.7
  Top Layer w0.254: U6.21 5.79,20.57 5.79,21.11 4.3,22.6 3.28,22.6 2.52,21.84 2.52,20.38 J1.13
SPI2_CS: length 19.5
  Top Layer w0.254: J1.20 2.77,2.86 2.77,6.41 v1(3.03,6.67) ; v1(11.28,14.54) 11.91,15.17 U6.33
  Bottom Layer w0.254: v1(3.03,6.67) 3.41,6.67 v1(11.28,14.54)
SPI2_MISO: length 17.6
  Top Layer w0.254: 12.62,16.89 13.19,16.32 13.19,15.81 v1(12.93,15.56)
  Bottom Layer w0.254: v1(12.93,15.56) 12.43,16.06 10.9,16.06 J1.18
SPI2_MOSI: length 19.6
  Top Layer w0.254: v1(13.19,14.79) 13.7,15.3 13.7,16.52 12.97,17.25
  Bottom Layer w0.254: J1.19 11.16,13.78 12.43,13.78 13.19,14.54 v1(13.19,14.79)
SPI2_SCK: length 14.9
  Top Layer w0.254: v1(11.38,17.43) U6.34
  Bottom Layer w0.254: v1(11.38,17.43) 2.9,8.95 J1.17
USART1_RX: length 34.2
  Top Layer w0.254: 15.45,19.72 15.37,19.72 11.66,23.43 11.66,28 10.65,29.02 10.65,29.27 13.44,32.06 13.44,32.57 12.68,33.33 10.65,33.33 3.03,40.95 3.03,42.73 J1.3
USART1_TX: length 36.1
  Top Layer w0.254: v1(8.49,26.98) 9,26.48 9,22.52 11.65,19.87 14.59,19.87 U6.42 ; v1(6.84,36.13) 6.84,35.37 v1(9.63,32.57)
  Bottom Layer w0.254: v1(9.63,32.57) 8.49,31.43 v1(8.49,26.98) ; J1.2 6.84,41.46 v1(6.84,36.13)
USART2_RX: length 19
  Top Layer w0.254: v1(3.61,21.98) 3.61,21.73 U6.17
  Bottom Layer w0.254: J1.5 3.36,37.32 3.36,22.23 v1(3.61,21.98)
USART2_TX: length 21.3
  Top Layer w0.254: v1(5.14,23.72) 4.38,23.72 U6.16
  Bottom Layer w0.254: v1(5.14,23.72) 5.14,38.08 J1.4
$1N878: length 6.3
  Top Layer w0.254: USBC1.A5 11.81,44.58 11.81,45.47 13.08,46.74 R1.1
$1N879: length 6.4
  Top Layer w0.254: USBC1.B5 8.76,44.53 8.76,45.6 7.49,46.87 R2.2
$1N882: length 9.3
  Top Layer w0.254: 13.05,43.34 v1(12.54,43.34) ; 13.05,43.34 13.05,42.58 13.5,42.12 ; 13.05,43.34 USBC1.A4 USBC1.B9 ; USBC1.A9 USBC1.B4 8.25,43.82 8.73,43.34 ; 8.73,43.34 8.67,43.34 U1.2 ; 8.73,43.34 v1(9.24,43.34)
  Bottom Layer w0.254: v1(12.54,43.34) v1(9.24,43.34)
$1N887: length 25.3
  Top Layer w0.254: LED1.2 13.97,9.82 13.97,13.63 v1(13.72,13.88) ; v1(15.75,29.12) 15.71,29.12 R3.1
  Bottom Layer w0.254: v1(15.75,29.12) 14.99,28.36 14.99,25.06 12.45,22.52 12.45,17.94 14.22,16.17 14.48,16.17 14.99,15.66 14.99,15.15 v1(13.72,13.88)
$1N888: length 15.5
  Top Layer w0.254: U4.3 9.08,40.4 U5.2 11.03,40.4 C2.1 12.19,39.25 12.19,38.22 12.92,37.49 12.92,36.57 14.21,35.28 14.21,33.67 ; 14.21,33.67 15.23,33.67 16.5,32.4 C7.1 ; 14.21,33.67 14.21,33.54
$1N4590: length 29.7
  Top Layer w0.254: U6.46 17.27,20.02 v1(17.37,20.02) ; v1(18.39,18.65) 18.54,18.5 18.54,13.57 19.05,13.06 v1(19.05,12.81)
  Bottom Layer w0.254: v1(19.05,12.81) 17.52,14.33 16.41,14.33 15.14,13.06 11.07,13.06 6.5,8.49 P1.2 ; v1(18.39,18.65) 18.39,19 v1(17.37,20.02)
$1N4596: length 31.4
  Top Layer w0.254: v1(16.88,13.66) 17.23,14.01 17.23,18.33 19.26,20.36 v1(20.28,20.36) ; v1(17.99,24.99) U6.49 ; v1(15.61,12.39) 15.61,8.07 15.18,7.64 12.13,7.64 8.5,4.01 P1.4
  Bottom Layer w0.254: v1(15.61,12.39) v1(16.88,13.66) ; v1(17.99,24.99) 17.99,21.63 19.26,20.36 v1(20.28,20.36)
$1N7474: length 2.4
  Top Layer w0.254: LED2.1 14.78,6.57 R10.2
$1N7510: length 20.8
  Top Layer w0.254: v1(10.98,18.79) 5.39,24.38 5.14,24.38 U6.14 ; R10.1 14.48,15.29 v1(14.28,15.49)
  Bottom Layer w0.254: v1(14.28,15.49) v1(10.98,18.79)

## Copper pours and planes (outline as drawn; the poured copper is in the pictures)
GND on Ground: 0,51 21,51 21,0.06 0,0.06
VCC on Power: 0,51 21,51 21,0 0,0

## Text on the board
Bottom Silkscreen Layer: ANALOG | USART1 | USART2 | I2C 1 | I2C 2 | SPI 1 | SPI 2 | RX | TX | CS | SCL | 3v3 | GND | SDA | SCK | MOSI | MISO | PC1 | PC2 | PC3 | PC4 | PC5 | PC0 | NC | PC7 | PB4 | PB3 | PB1 | PB0 | PB6 | PC6 | PB5 | PB2 | PC8 | PC9 | by shuchir
Top Silkscreen Layer: RESET | BOOT
